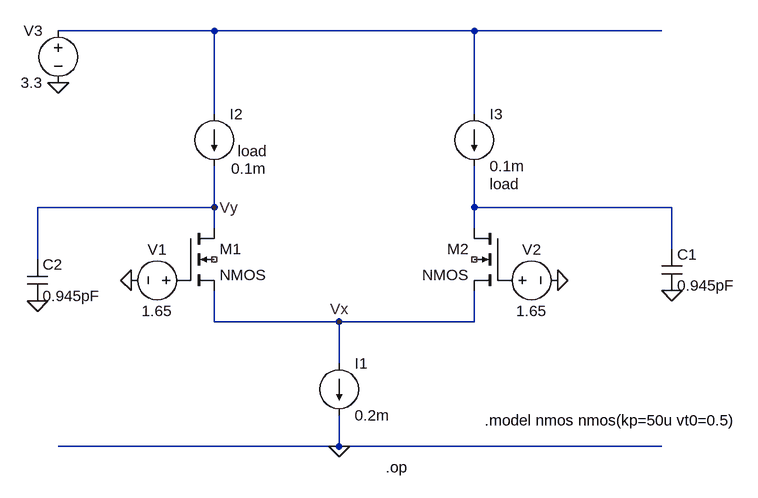
[diagram p0: schematic Transcondoctur.asc]
Transcondoctur.asc, the LTspice schematic file:
Version 4
SHEET 1 1012 680
WIRE 0 -176 -240 -176
WIRE 400 -176 0 -176
WIRE 688 -176 400 -176
WIRE 0 -48 0 -176
WIRE 400 -48 400 -176
WIRE 0 96 0 32
WIRE 0 96 -272 96
WIRE 400 96 400 32
WIRE 704 96 400 96
WIRE 0 128 0 96
WIRE 400 128 400 96
WIRE 704 160 704 96
WIRE -272 176 -272 96
WIRE 0 272 0 224
WIRE 192 272 0 272
WIRE 400 272 400 224
WIRE 400 272 192 272
WIRE 192 336 192 272
WIRE 192 464 192 416
WIRE 192 464 -240 464
WIRE 688 464 192 464
FLAG -240 -96 0
FLAG 192 464 0
FLAG -128 208 0
FLAG 528 208 0
FLAG -272 240 0
FLAG 704 224 0
FLAG 192 272 Vx
FLAG 0 96 Vy
SYMBOL current 192 336 R0
WINDOW 123 0 0 Left 0
WINDOW 39 24 108 Left 2
SYMATTR InstName I1
SYMATTR Value 0.2m
SYMBOL voltage -32 208 R90
WINDOW 0 -32 56 VBottom 2
WINDOW 3 32 56 VTop 2
WINDOW 123 60 56 VTop 2
WINDOW 39 0 0 Left 0
SYMATTR InstName V1
SYMATTR Value 1.65
SYMBOL voltage 432 208 M90
WINDOW 0 -32 56 VBottom 2
WINDOW 3 32 56 VTop 2
SYMATTR InstName V2
SYMATTR Value 1.65
SYMBOL voltage -240 -192 M0
WINDOW 123 0 0 Left 0
WINDOW 39 0 0 Left 0
SYMATTR InstName V3
SYMATTR Value 3.3
SYMBOL cap 688 160 R0
SYMATTR InstName C1
SYMATTR Value 0.945pF
SYMBOL cap -288 176 R0
SYMATTR InstName C2
SYMATTR Value 0.945pF
SYMBOL nmos4 -48 128 R0
SYMATTR InstName M1
SYMATTR Value2 l=1u w=100u
SYMBOL nmos4 448 128 M0
SYMATTR InstName M2
SYMATTR Value2 l=1u w=100u
SYMBOL current 0 -48 R0
WINDOW 3 26 84 Left 2
WINDOW 123 0 0 Left 0
WINDOW 39 36 57 Left 2
SYMATTR InstName I2
SYMATTR Value 0.1m
SYMATTR SpiceLine load
SYMBOL current 400 -48 R0
WINDOW 123 0 0 Left 0
WINDOW 39 24 108 Left 2
SYMATTR InstName I3
SYMATTR Value 0.1m
SYMATTR SpiceLine load
TEXT 264 496 Left 2 !.op
TEXT 416 424 Left 2 !.model nmos nmos(kp=50u vt0=0.5)

The netlist it stands for:
* Transcondoctur.asc
I1 Vx 0 0.2m
V1 P001 0 1.65
V2 P002 0 1.65
V3 N001 0 3.3
C1 N002 0 0.945pF
C2 Vy 0 0.945pF
M1 Vy P001 Vx NC_01 NMOS l=1u w=100u
M2 N002 P002 Vx NC_02 NMOS l=1u w=100u
I2 N001 Vy 0.1m load
I3 N001 N002 0.1m load
.model NMOS NMOS
.model PMOS PMOS
.lib standard.mos
.op
.model nmos nmos(kp=50u vt0=0.5)
.backanno
.end